# Altium schematic sheet Bluetooth Transmitter.SchDoc
size A; SheetNumber: 2; SheetTotal: 2; SPICEModelCacheFFAFCORI: <root> / <DocumentId>FFAFCORI</DocumentId> / <CacheFrame Number="0"> / <Model Name="cap" Kind="MDL"> / <Text>*Default semiconductor capacitor / .MODEL CAP C()</Text> / </Model> / </CacheFrame> / </root>
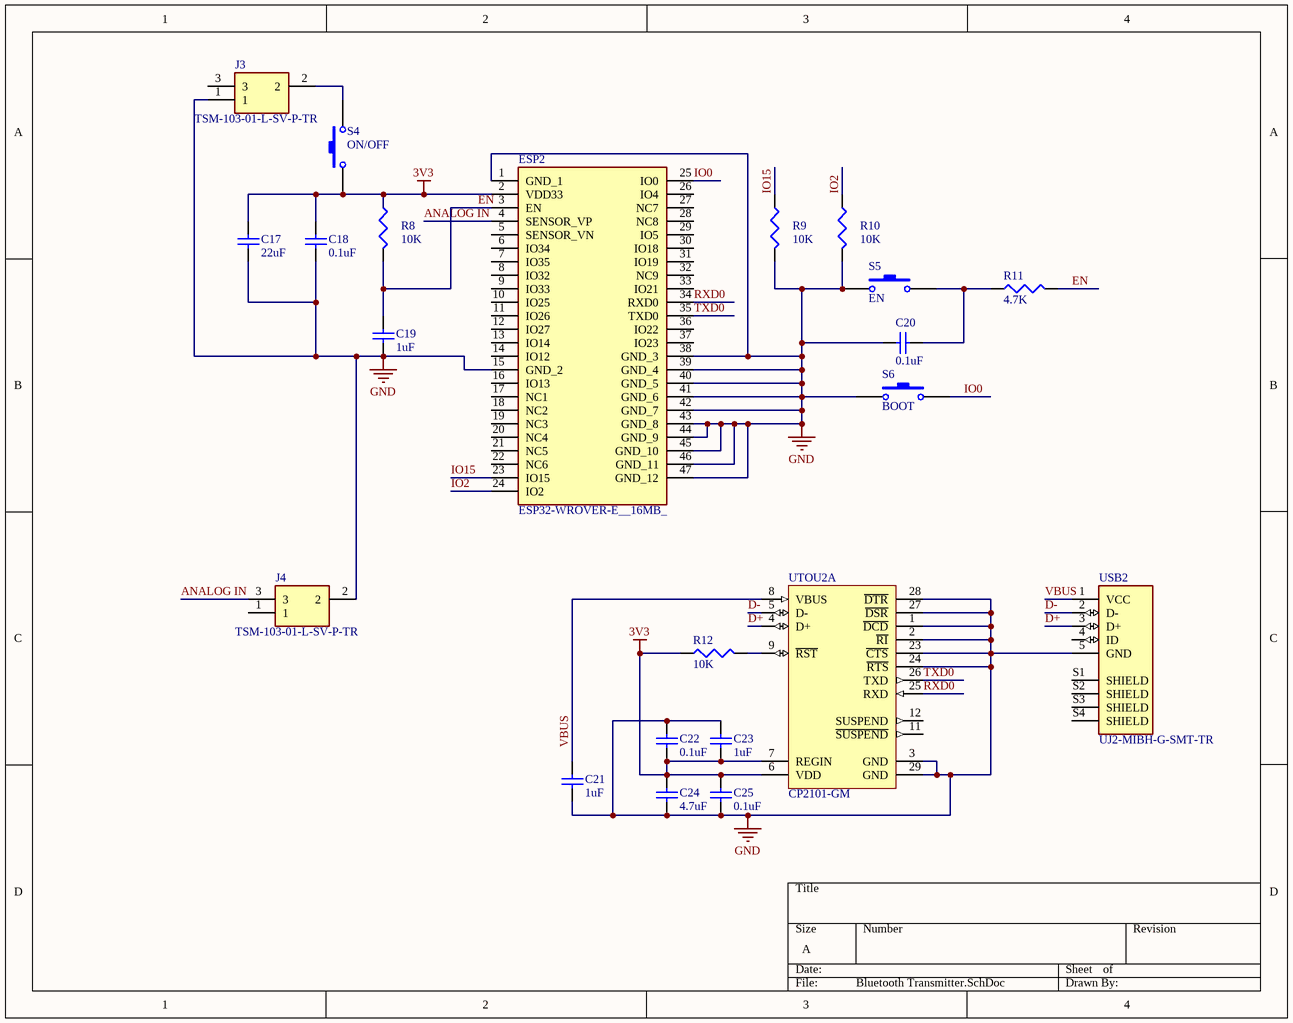
[diagram p0: Bluetooth Transmitter.SchDoc]

## Parts
C17  value 22uF  [1608[0603]]  (hidden comment: Cap)
C18  value 0.1uF  [1608[0603]]  (hidden comment: Cap)
C19  value 1uF  [1608[0603]]  (hidden comment: Cap)
C20  value 0.1uF  [1608[0603]]  (hidden comment: Cap)
C21  value 1uF  [1608[0603]]  (hidden comment: Cap)
C22  value 0.1uF  [1608[0603]]  (hidden comment: Cap)
C23  value 1uF  [1608[0603]]  (hidden comment: Cap)
C24  value 4.7uF  [1608[0603]]  (hidden comment: Cap)
C25  value 0.1uF  [1608[0603]]  (hidden comment: Cap)
ESP2  ESP32-WROVER-E__16MB_  [ESP32WROVERE16MB]
J3  TSM-103-01-L-SV-P-TR  [TSM10301LSVPTR]
J4  TSM-103-01-L-SV-P-TR  [TSM10301LSVPTR]
R8  value 10K  [J1-0603]  (hidden comment: Res3)
R9  value 10K  [J1-0603]  (hidden comment: Res3)
R10  value 10K  [J1-0603]  (hidden comment: Res3)
R11  value 4.7K  [J1-0603]  (hidden comment: Res3)
R12  value 10K  [J1-0603]  (hidden comment: Res3)
S4  ON/OFF  [R1966ABLKBLKEF]
S5  EN  [R1966ABLKBLKEF]
S6  BOOT  [R1966ABLKBLKEF]
USB2  UJ2-MIBH-G-SMT-TR  [CUI_UJ2-MIBH-G-SMT-TR]
UTOU2  CP2101-GM  [SLAB-QFN-28-3125x3125TP_A_N]  (part A of 2)

## Nets
3V3: C17.2 C18.2 C22.1 C23.1 C24.2 C25.2 ESP2.2(VDD33) R8.1 R12.1 S4.1 UTOU2.6(VDD) UTOU2.7(REGIN)
GND: C17.1 C18.1 C19.1 C20.2 C21.1 C22.2 C23.2 C24.1 C25.1 ESP2.1(GND_1) ESP2.15(GND_2) ESP2.38(GND_3) ESP2.39(GND_4) ESP2.40(GND_5) ESP2.41(GND_6) ESP2.42(GND_7) ESP2.43(GND_8) ESP2.44(GND_9) ESP2.45(GND_10) ESP2.46(GND_11) ESP2.47(GND_12) J3.1 J4.2 R9.2 R10.2 S5.1 S6.1 USB2.5(GND) UTOU2.1(~{DCD}) UTOU2.2(~{RI}) UTOU2.3(GND) UTOU2.23(~{CTS}) UTOU2.24(~{RTS}) UTOU2.27(~{DSR}) UTOU2.28(~{DTR}) UTOU2.29(GND)
ANALOG IN: ESP2.4(SENSOR_VP) J4.3
D+: USB2.3(D+) UTOU2.4(D+)
D-: USB2.2(D-) UTOU2.5(D-)
EN: C19.2 ESP2.3(EN) R8.2 R11.2
IO0: ESP2.25(IO0) S6.2
IO2: ESP2.24(IO2) R10.1
IO15: ESP2.23(IO15) R9.1
RXD0: ESP2.34(RXD0) UTOU2.25(RXD)
TXD0: ESP2.35(TXD0) UTOU2.26(TXD)
VBUS: C21.2 USB2.1(VCC) UTOU2.8(VBUS)
NetC20_1: C20.1 R11.1 S5.2
NetJ3_2: J3.2 S4.2
NetR12_2: R12.2 UTOU2.9(~{RST})

Not connected (* = marked no-connect by the designer): ESP2 5(SENSOR_VN) 6(IO34) 7(IO35) 8(IO32) 9(IO33) 10(IO25) 11(IO26) 12(IO27) 13(IO14) 14(IO12) 16(IO13) 17(NC1) 18(NC2) 19(NC3) 20(NC4) 21(NC5) 22(NC6) 26(IO4) 27(NC7) 28(NC8) 29(IO5) 30(IO18) 31(IO19) 32(NC9) 33(IO21) 36(IO22) 37(IO23); J3 3; J4 1; USB2 4(ID) S1(SHIELD) S2(SHIELD) S3(SHIELD) S4(SHIELD); UTOU2 11(~{SUSPEND}) 12(SUSPEND)

## Library data of the parts
C17-C25 = Cap Semi: Capacitor (Semiconductor SIM Model); Published: 8-Jun-2000; LatestRevisionDate: 29-May-2009; LatestRevisionNote: IPC-7351 Footprint Added.; PackageReference: C1206; Publisher: Altium Limited; PackageDescription: Chip Capacitor
ESP2 = ESP32-WROVER-E__16MB_: Integrated Circuit; Manufacturer_Name: Espressif Systems; Manufacturer_Part_Number: ESP32-WROVER-E (16MB); Datasheet Link: https://www.espressif.com/sites/default/files/documentation/esp32-wrover_datasheet_en.pdf; Height: 3.4mm; Mouser Part Number: 356-ESP32WRVE22864PC; Mouser Price/Stock: https://www.mouser.co.uk/ProductDetail/Espressif-Systems/ESP32-WROVER-E-16MB?qs=GBLSl2Akirv1e4kp%252BlJr4g%3D%3D
J3 J4 = TSM-103-01-L-SV-P-TR: Connector; Manufacturer_Name: SAMTEC; Datasheet Link: https://datasheet.datasheetarchive.com/originals/dk/DKDS40/DSANUWW0019078.pdf; Manufacturer_Part_Number: TSM-103-01-L-SV-P-TR; Mouser Part Number: 200-TSM10301LSVPTR; Mouser Price/Stock: https://www.mouser.co.uk/ProductDetail/Samtec/TSM-103-01-L-SV-P-TR?qs=DZ6FV2pdG5tjRaLOEfFPgw%3D%3D; Arrow Part Number: TSM-103-01-L-SV-P-TR; Arrow Price/Stock: https://www.arrow.com/en/products/tsm-103-01-l-sv-p-tr/samtec?region=europe
R8-R12 = Res3: Resistor; Published: 8-Jun-2000; LatestRevisionDate: 29-May-2009; LatestRevisionNote: IPC-7351 Footprint Added.; PackageReference: J1-0603; Publisher: Altium Limited; PackageDescription: Chip Resistor
S4-S6 = SW-PB: Switch; Published: 24-Mar-1999; LatestRevisionDate: 17-Jul-2002; LatestRevisionNote: Re-released for DXP Platform.; PackageReference: SPST-2; Publisher: Altium Limited; PackageDescription: Switch; 2 Leads
USB2 = UJ2-MIBH-G-SMT-TR: USB micro B type receptacle; Price: None; Value: *; Package: None; Availability: Unavailable; MP: UJ2-MIBH-G-SMT-TR
UTOU2 = CP2101-GM: Single-Chip USB to UART Bridge, 512 Bytes EEPROM, -40 to 85 degC, 28-pin QFN, Tube; Manufacturer: Silicon Labs; Sub-Family: USB Bridges; Internal Oscillator: TRUE; ComponentLink1Description: Manufacturer URL; ComponentLink2Description: Datasheet; ComponentLink3Description: Package Specification; ComponentLink3URL: http://www.silabs.com/Support%20Documents/TechnicalDocs/C8051F35x.pdf; DatasheetVersion: Rev. 1.8; ComponentLink1URL: http://www.silabs.com/; ComponentLink2URL: http://www.silabs.com/Support%20Documents/TechnicalDocs/CP2101.pdf; Mounting Technology: Surface Mount; PackageDescription: 28-Pin Quad-Flat No-Leads Package, Body 5 x 5 mm, Pitch 0.5 mm; PartNumber: CP2101-GM; EEPROM: 512 Bytes; PackageReference: QFN-28